# EasyEDA Pro project ChisFlash v1.1 雪拉比 时钟卡.epro

# Schematic ChisFlash-Celebi
Board Name: ChisFlash-Celebi; Create Date: 2024-10-07; Page Name: P1; Project Name: ChisFlash v1.1 雪拉比 Flash1M/RTC; Schematic Name: ChisFlash-Celebi; Update Date: 2024-10-07; Company: ChisBread/ChisFlash-Prometheus; Drawed: ChisBread; Page Size: A4; Reviewed: ChisBread; Version: 2
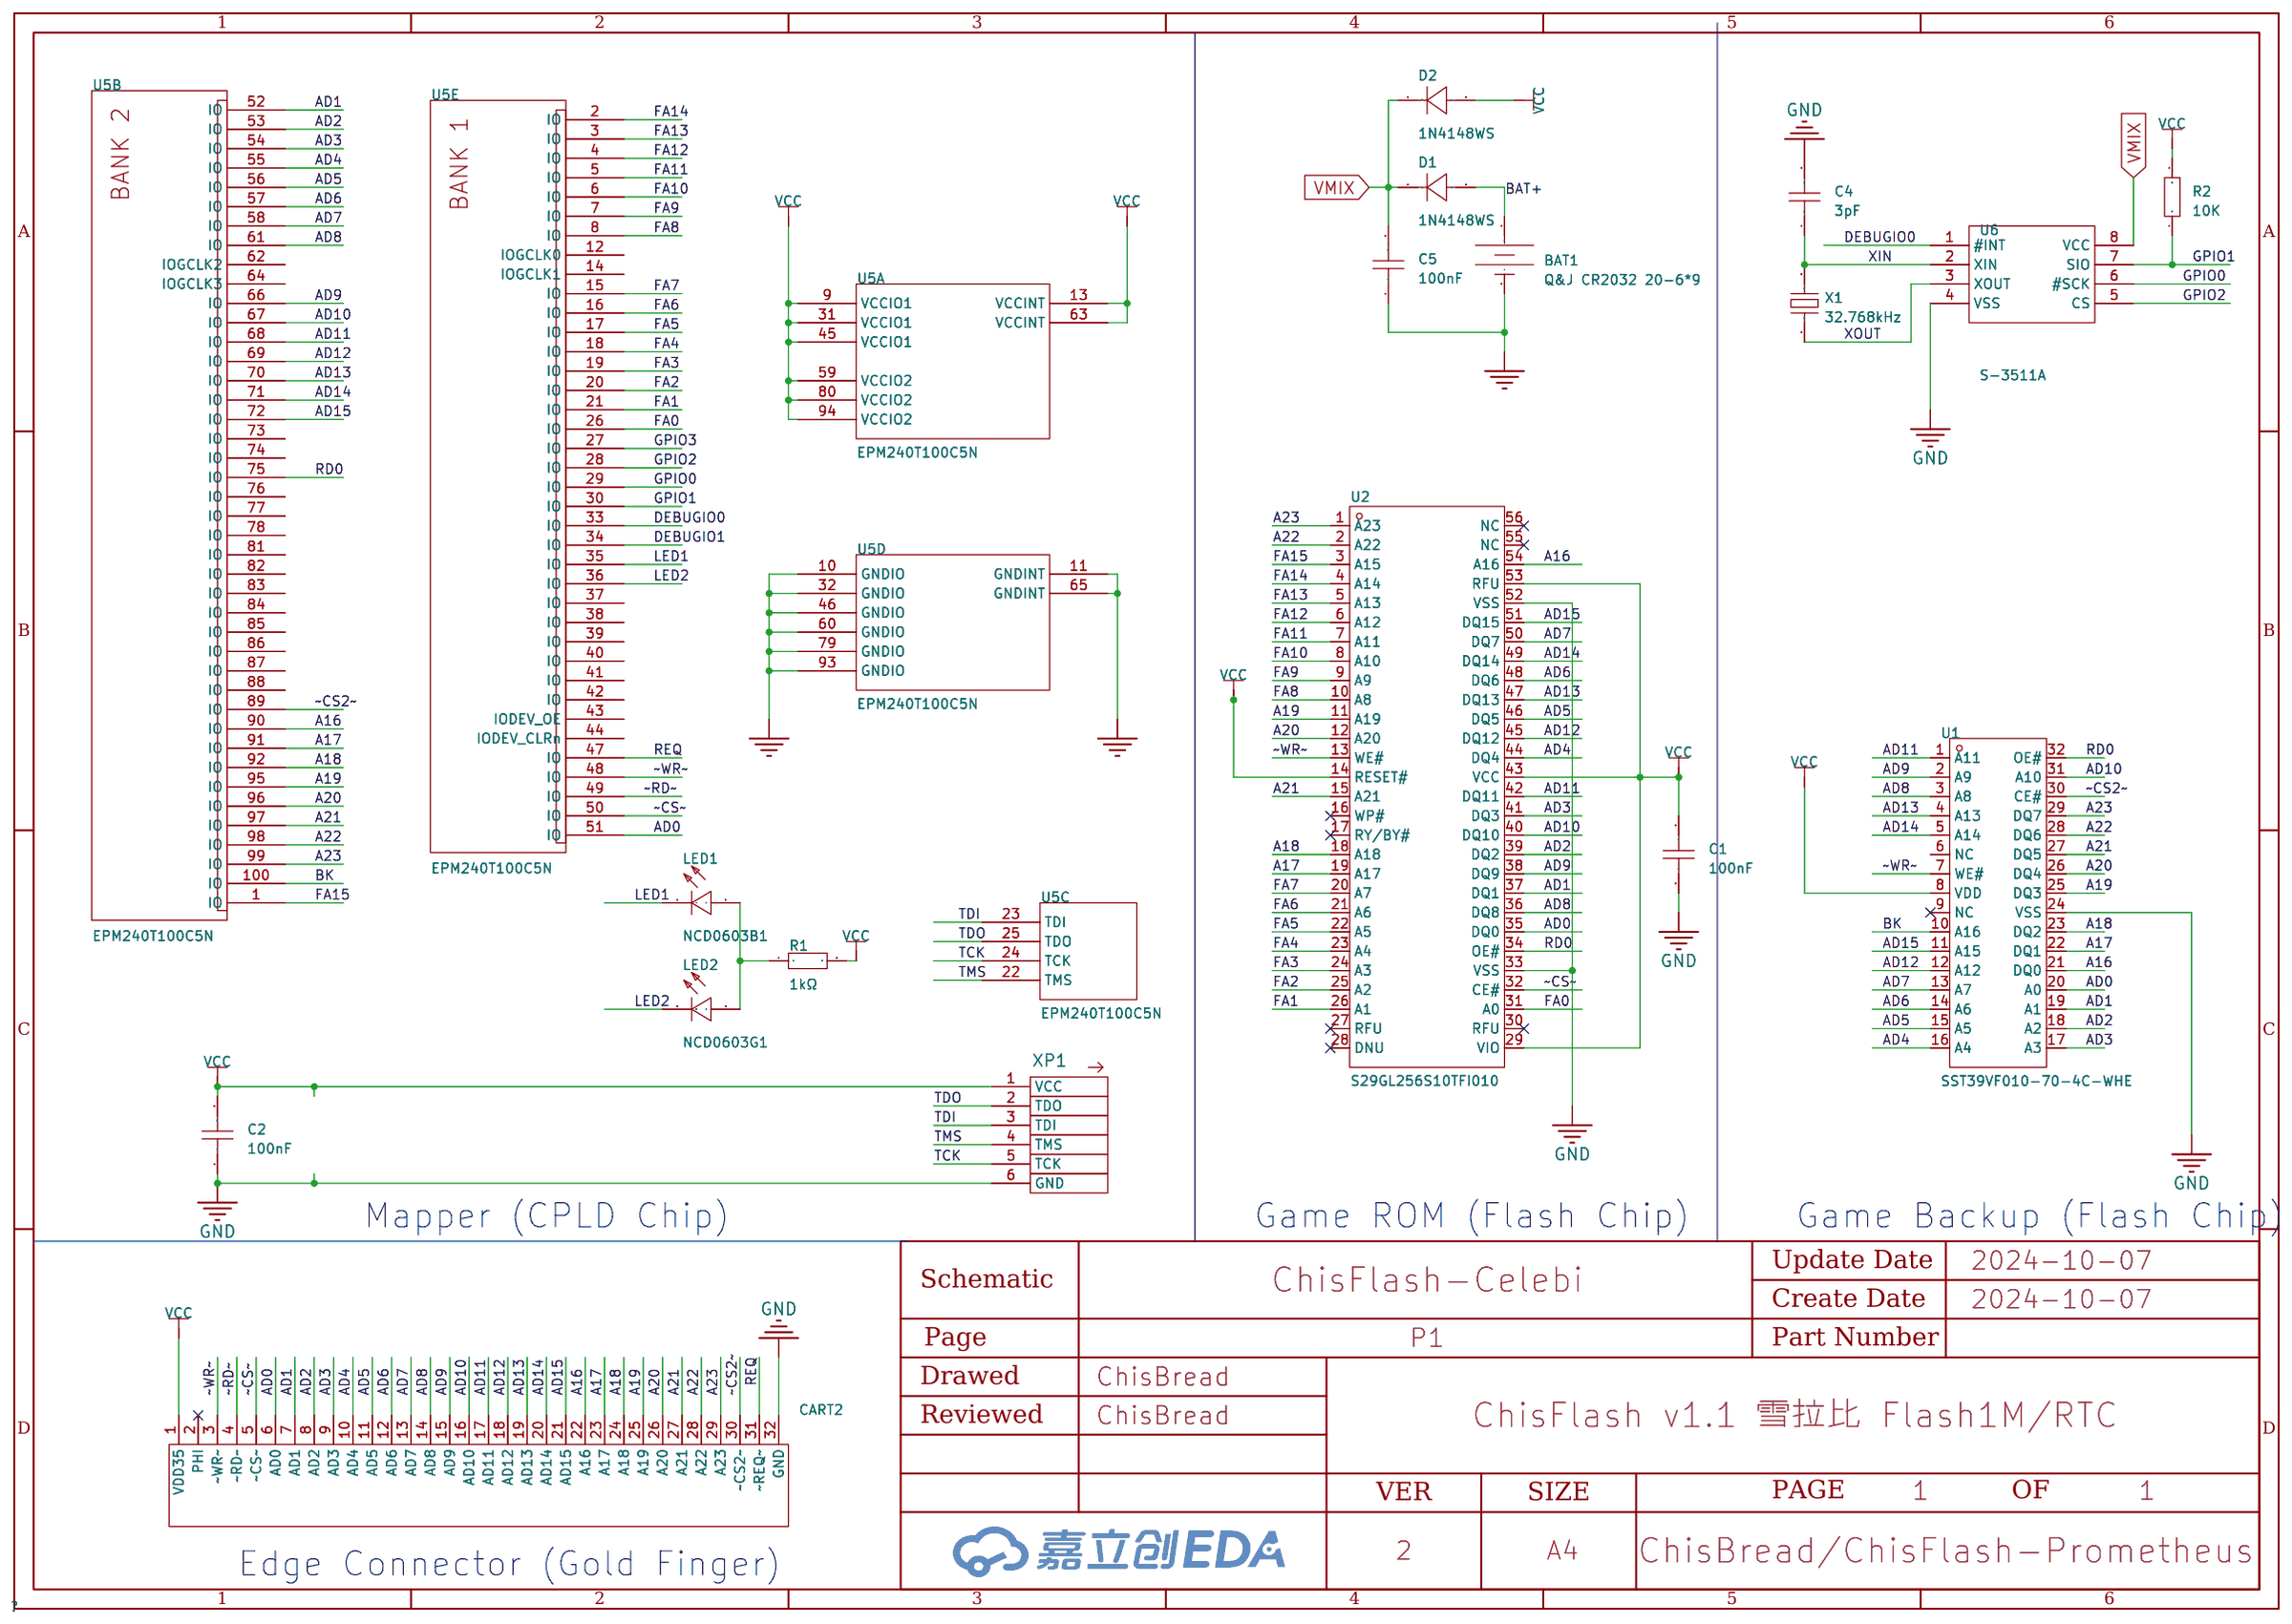
[diagram p0: schematic sheet]

## Parts
BAT1  Q&J CR2032 20-6*9  [BAT-TH_CR2032]
C1  100nF  [C0603]
C2  100nF  [C0603]
C4  3pF  [C0603]
C5  100nF  [C0603]
CART2  -  [GBA卡带金手指]  (no BOM)
D1  1N4148WS  [SOD-323_L1.8-W1.3-LS2.5-RD]
D2  1N4148WS  [SOD-323_L1.8-W1.3-LS2.5-RD]
LED1  NCD0603B1  [LED0603-RD]
LED2  NCD0603G1  [LED0603-RD]
R1  1kΩ  [R0603]
R2  10K  [R0603]
U1  SST39VF010-70-4C-WHE  [TSOP-32_L8.1-W12.5-P0.50-LS14.2-TL]
U2  S29GL256S10TFI010  [TSOP-56_L18.4-W14.0-P0.50-LS20.0-TL]
U5  EPM240T100C5N  [TQFP-100_L14.0-W14.0-P0.50-LS16.0-BL]  (sections 1,2,3,4,5)
U6  S-3511A  [3511-sop8]
X1  32.768kHz  [OSC-SMD_L3.2-W1.5]
XP1  JTAG  [HDR-TH_6P-P1.27-V-M-1]  (no BOM)

## Library data of the parts
BAT1 = Q&J CR2032 20-6*9: 直插; LCSC Part Name: Q&J， (卧式焊脚)纽扣电池，3V， CR2032 ,1只; Supplier Part: C70382; Manufacturer: Q&J; JLCPCB Part Class: Extended Part; Datasheet: https://atta.szlcsc.com/upload/public/pdf/source/20170428/1493376822625.pdf; Supplier: LCSC; brand: Q&J; voltage: 3v; capacity: 240mAh; chemical composition: 锂锰; temperature range: -20-60°C; size: 20*3.2mm; type: 纽扣; Packaging quantity: 1
C1 C2 C4 C5 = CAP_0603: Supplier Footprint: 0603
CART2 = GBA卡带金手指
D1 D2 = 1N4148WS_C917117: 二极管配置:独立式;正向压降(Vf):1.25V@150mA;直流反向耐压(Vr):100V;平均整流电流(Io):300mA;功率:400mW;反向恢复时间(trr):8ns;; LCSC Part Name: 电压:100V 电流:300mA; Supplier Part: C917117; Manufacturer: JSMSEMI(杰盛微); Supplier Footprint: SOD-323; JLCPCB Part Class: Extended Part; Datasheet: https://atta.szlcsc.com/upload/public/pdf/source/20230807/08D9F448A82EA88A23B325A669586A09.pdf; Supplier: LCSC; Diode Configuration: 独立式; Forward Voltage (Vf@If): 1.25V@150mA; Reverse Voltage (Vr): 100V; Average Rectified Current (Io): 300mA; Power Dissipation: 400mW; Reverse Leakage Current: 1uA@75V; Reverse Recovery Time (trr): 8ns; Operating Temperature: -55℃~+150℃@(Tj)
LED1 = NCD0603B1: 发光颜色:蓝色;正向电压(VF):2.6V~3.6V;功率:72mW;正向电流:10mA;主波长:463nm~475nm;透镜颜色:无色透明透镜;发光强度:80mcd~220mcd;发光角度:130°;工作温度:-30℃~+85℃;; Supplier Part: C84266; Manufacturer: 国星光电; Supplier Footprint: 0603; JLCPCB Part Class: 扩展库; Datasheet: https://atta.szlcsc.com/upload/public/pdf/source/20200820/C84266_6A3CDBEFA72C6CAD68EDA53474ADAE6C.pdf; Supplier: LCSC; Emitted Color: 蓝色; Forward Voltage (VF): 2.6V~3.6V; Power Dissipation: 72mW; Forward Current: 10mA; Dominant Wavelength: 463nm~475nm; Lens Color: 无色透明透镜; Luminous Intensity: 80mcd~220mcd; Viewing Angle: 130°; Operating Temperature: -30℃~+85℃
LED2 = NCD0603G1: 发光颜色:翠绿色;正向电压(VF):2.6V~3.6V;功率:72mW;正向电流:10mA;主波长:515nm~530nm;透镜颜色:无色透明透镜;发光强度:330mcd~900mcd;发光角度:130°;工作温度:-30℃~+85℃;; Supplier Part: C84267; Manufacturer: 国星光电; Supplier Footprint: 0603; JLCPCB Part Class: 扩展库; Datasheet: https://atta.szlcsc.com/upload/public/pdf/source/20200820/C84267_04BA7703640BAC111D09F5EFB971FBF3.pdf; Supplier: LCSC; Emitted Color: 翠绿色; Forward Voltage (VF): 2.6V~3.6V; Power Dissipation: 72mW; Forward Current: 10mA; Dominant Wavelength: 515nm~530nm; Lens Color: 无色透明透镜; Luminous Intensity: 330mcd~900mcd; Viewing Angle: 130°; Operating Temperature: -30℃~+85℃
R1 = 0603WAF1001T5E: 电阻类型:厚膜电阻;阻值:1kΩ;精度:±1%;功率:100mW;最大工作电压:75V;温度系数:±100ppm/℃;; LCSC Part Name: 1kΩ ±1% 100mW 厚膜电阻; Supplier Part: C21190; Manufacturer: UNI-ROYAL(厚声); Supplier Footprint: 0603; JLCPCB Part Class: 基础库; Datasheet: https://atta.szlcsc.com/upload/public/pdf/source/20200306/C422600_1E6D84923E4A46A82E41ADD87F860B5C.pdf; Supplier: LCSC; Type: 厚膜电阻; Tolerance: ±1%; Power(Watts): 100mW; Overload Voltage (Max): 75V; Temperature Coefficient: ±100ppm/℃; Operating Temperature Range: -55℃~+155℃
R2 = Res_0603: Supplier Footprint: 0603
U1 = SST39VF010-70-4C-WHE: Supplier Part: C633802; Manufacturer: MICROCHIP(美国微芯); Supplier Footprint: TSOP-32-12.5mm; JLCPCB Part Class: Extended Part; Datasheet: https://atta.szlcsc.com/upload/public/pdf/source/20140805/1457707202769.pdf; Supplier: LCSC
U2 = S29GL256S10TFI010: Supplier Part: C1350995; Manufacturer: SPANSION(飞索); Supplier Footprint: TSOP-56; JLCPCB Part Class: Extended Part; Datasheet: https://atta.szlcsc.com/upload/public/pdf/source/20201109/C914940_4A5E28132C9BE0EE19A790F58F84C86D.pdf; Supplier: LCSC
U5 = EPM240T100C5N: 类型:其它PLD;逻辑门数量:-;逻辑单元数:-;逻辑阵列块数:240;; Supplier Part: C10041; Manufacturer: Intel/Altera; Supplier Footprint: TQFP-100(14x14); JLCPCB Part Class: 扩展库; Datasheet: https://atta.szlcsc.com/upload/public/pdf/source/20121123/1457706563537.pdf; Supplier: LCSC; Type: 其它PLD; Supply Voltage Range - VCCIO: 3.3V；2.5V; Logic Array Blocks: 240; Maximum Delay Time Tpd: 4.7ns; Operating Temperature Range: 0℃~+85℃
U6 = 3511-SOP8: JLCPCB Part Class: 扩展库
X1 = X321532768KGD2SI: 晶振类型:贴片晶振;频率:32.768kHz;常温频差:±20ppm;外接负载电容:12.5pF;频率稳定度(全温):-;; LCSC Part Name: 32.768kHz ±20ppm 12.5pF; Supplier Part: C620155; Manufacturer: YXC(扬兴晶振); Supplier Footprint: SMD3215-2P; JLCPCB Part Class: Extended Part; Datasheet: https://atta.szlcsc.com/upload/public/pdf/source/20240329/3A7650FD985DD0DE85694D3785AB4916.pdf; Supplier: LCSC; Crystal Type: 贴片晶振; Normal temperature Frequency Tolerance: ±20ppm; External load capacitor: 12.5pF; Operating Temperature: -40℃~+85℃
XP1 = jtag

## Nets
GND: BAT1.2(-) C1.1 C2.1 C4.2 C5.1 CART2.32(GND) U1.24(VSS) U2.33(VSS) U2.52(VSS) U5.10(GNDIO) U5.11(GNDINT) U5.32(GNDIO) U5.46(GNDIO) U5.60(GNDIO) U5.65(GNDINT) U5.79(GNDIO) U5.93(GNDIO) U6.4(VSS) XP1.6(GND)
VCC: C1.2 C2.2 CART2.1(VDD35) D2.2(A) R1.2 R2.2 U1.8(VDD) U2.14(RESET#) U2.29(VIO) U2.43(VCC) U2.53(RFU) U5.9(VCCIO1) U5.13(VCCINT) U5.31(VCCIO1) U5.45(VCCIO1) U5.59(VCCIO2) U5.63(VCCINT) U5.80(VCCIO2) U5.94(VCCIO2) XP1.1(VCC)
A16: CART2.22(A16) U1.21(DQ0) U2.54(A16) U5.90(IO)
A17: CART2.23(A17) U1.22(DQ1) U2.19(A17) U5.91(IO)
A18: CART2.24(A18) U1.23(DQ2) U2.18(A18) U5.92(IO)
A19: CART2.25(A19) U1.25(DQ3) U2.11(A19) U5.95(IO)
A20: CART2.26(A20) U1.26(DQ4) U2.12(A20) U5.96(IO)
A21: CART2.27(A21) U1.27(DQ5) U2.15(A21) U5.97(IO)
A22: CART2.28(A22) U1.28(DQ6) U2.2(A22) U5.98(IO)
A23: CART2.29(A23) U1.29(DQ7) U2.1(A23) U5.99(IO)
AD0: CART2.6(AD0) U1.20(A0) U2.35(DQ0) U5.51(IO)
AD1: CART2.7(AD1) U1.19(A1) U2.37(DQ1) U5.52(IO)
AD2: CART2.8(AD2) U1.18(A2) U2.39(DQ2) U5.53(IO)
AD3: CART2.9(AD3) U1.17(A3) U2.41(DQ3) U5.54(IO)
AD4: CART2.10(AD4) U1.16(A4) U2.44(DQ4) U5.55(IO)
AD5: CART2.11(AD5) U1.15(A5) U2.46(DQ5) U5.56(IO)
AD6: CART2.12(AD6) U1.14(A6) U2.48(DQ6) U5.57(IO)
AD7: CART2.13(AD7) U1.13(A7) U2.50(DQ7) U5.58(IO)
AD8: CART2.14(AD8) U1.3(A8) U2.36(DQ8) U5.61(IO)
AD9: CART2.15(AD9) U1.2(A9) U2.38(DQ9) U5.66(IO)
AD10: CART2.16(AD10) U1.31(A10) U2.40(DQ10) U5.67(IO)
AD11: CART2.17(AD11) U1.1(A11) U2.42(DQ11) U5.68(IO)
AD12: CART2.18(AD12) U1.12(A12) U2.45(DQ12) U5.69(IO)
AD13: CART2.19(AD13) U1.4(A13) U2.47(DQ13) U5.70(IO)
AD14: CART2.20(AD14) U1.5(A14) U2.49(DQ14) U5.71(IO)
AD15: CART2.21(AD15) U1.11(A15) U2.51(DQ15) U5.72(IO)
BAT+: BAT1.1(+) D1.2(A)
BK: U1.10(A16) U5.100(IO)
DEBUGIO0: U5.33(IO) U6.1(#INT)
DEBUGIO1: U5.34(IO)
FA0: U2.31(A0) U5.26(IO)
FA1: U2.26(A1) U5.21(IO)
FA2: U2.25(A2) U5.20(IO)
FA3: U2.24(A3) U5.19(IO)
FA4: U2.23(A4) U5.18(IO)
FA5: U2.22(A5) U5.17(IO)
FA6: U2.21(A6) U5.16(IO)
FA7: U2.20(A7) U5.15(IO)
FA8: U2.10(A8) U5.8(IO)
FA9: U2.9(A9) U5.7(IO)
FA10: U2.8(A10) U5.6(IO)
FA11: U2.7(A11) U5.5(IO)
FA12: U2.6(A12) U5.4(IO)
FA13: U2.5(A13) U5.3(IO)
FA14: U2.4(A14) U5.2(IO)
FA15: U2.3(A15) U5.1(IO)
GPIO0: U5.29(IO) U6.6(#SCK)
GPIO1: R2.1 U5.30(IO) U6.7(SIO)
GPIO2: U5.28(IO) U6.5(CS)
GPIO3: U5.27(IO)
LED1: LED1.1(-) U5.35(IO)
LED2: LED2.1(K) U5.36(IO)
RD0: U1.32(OE#) U2.34(OE#) U5.75(IO)
REQ: CART2.31(~REQ~) U5.47(IO)
TCK: U5.24(TCK) XP1.5(TCK)
TDI: U5.23(TDI) XP1.3(TDI)
TDO: U5.25(TDO) XP1.2(TDO)
TMS: U5.22(TMS) XP1.4(TMS)
VMIX: C5.2 D1.1(C) D2.1(C) U6.8(VCC)
XIN: C4.1 U6.2(XIN) X1.2
XOUT: U6.3(XOUT) X1.1
~CS2~: CART2.30(~CS2~) U1.30(CE#) U5.89(IO)
~CS~: CART2.5(~CS~) U2.32(CE#) U5.50(IO)
~RD~: CART2.4(~RD~) U5.49(IO)
~WR~: CART2.3(~WR~) U1.7(WE#) U2.13(WE#) U5.48(IO)
$1N77583: LED1.2(+) LED2.2(A) R1.1

Not connected (* = marked no-connect by the designer): CART2 2(PHI)*; U1 6(NC) 9(NC)*; U2 16(WP#)* 17(RY/BY#)* 27(RFU)* 28(DNU)* 30(RFU)* 55(NC)* 56(NC)*; U5 12(IOGCLK0) 14(IOGCLK1) 37(IO) 38(IO) 39(IO) 40(IO) 41(IO) 42(IO) 43(IODEV_OE) 44(IODEV_CLRn) 62(IOGCLK2) 64(IOGCLK3) 73(IO) 74(IO) 76(IO) 77(IO) 78(IO) 81(IO) 82(IO) 83(IO) 84(IO) 85(IO) 86(IO) 87(IO) 88(IO)

## Notes on the sheet
- Mapper (CPLD Chip)
- Game ROM (Flash Chip)
- Game Backup (Flash Chip)
- Edge Connector (Gold Finger)

# Board ChisFlash-Celebi
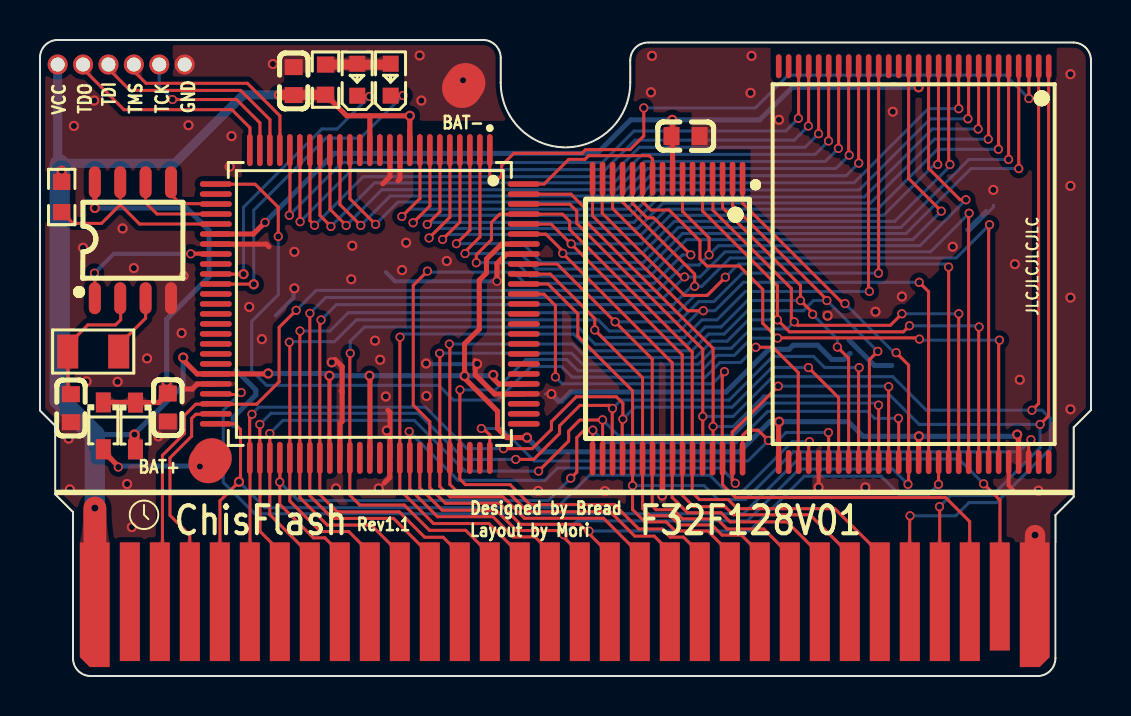
[diagram p1: board, top side]
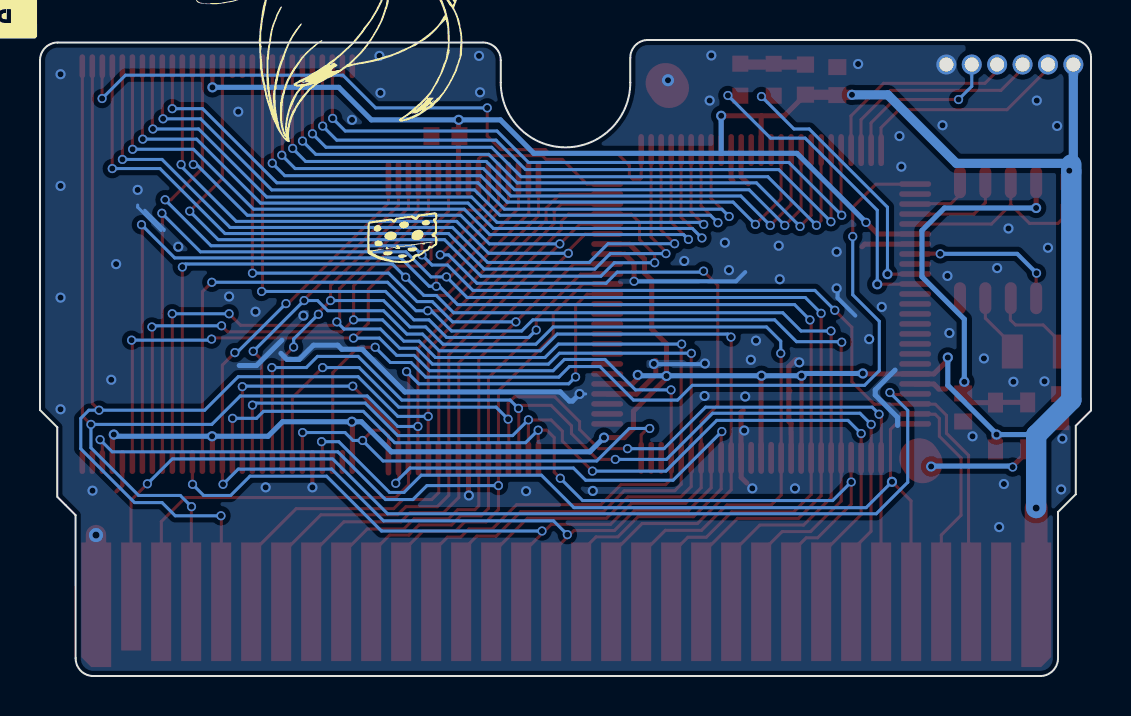
[diagram p2: board, bottom side, seen from below]

Outline 52.55 x 31.83 mm; copper layers: Top Layer, Bottom Layer. Coordinates in mm from the lower left corner of the outline.
Outline path: 0,30.94 0,13.28 0.76,12.52 0.76,9.09 1.65,8.2 1.65,0.89 arc(1.91,0.26) 2.54,0 49.88,0 arc(50.51,0.26) 50.77,0.89 50.77,8.05 51.28,8.56 51.69,8.97 51.69,12.45 52.55,13.31 52.55,30.81 arc(52.29,31.44) 51.66,31.7 30.4,31.7 arc(29.77,31.44) 29.51,30.81 29.52,29.69 arc(26.28,26.45) 23.04,29.69 23.04,30.94 arc(22.78,31.57) 22.15,31.83 0.89,31.83 arc(0.26,31.57) 0,30.94
Stack: Top Layer 0.035mm - / Dielectric1 1.51mm FR4 er 4.5 / Bottom Layer 0.035mm -

## Design rules (mm)
template: 自定义配置
spacing copperThickness1oz (default): track to track 0.152, other pairs 0.152 to 0.152
spacing copperThickness2oz: track to track 0.152, other pairs 0.152 to 0.152
track width copperThickness1oz (default): min 0.152, default 0.152, max 2.54
track width copperThickness2oz: min 0.152, default 0.254, max 2.54
differential pair differentialPair (default): width min 0.152, default 0.254, max 2.54; gap min 0.152, default 0.152
via viaSize (default): diameter min 0.406, default 0.457, max 10; hole min 0.305, default 0.305, max 6.299

## Placement (name value [footprint] x y rotation side)
BAT1  Q&J CR2032 20-6*9  [BAT-TH_CR2032]  14.83 20.14 236 top
C1  100nF  [C0603]  32.28 27.02 180 top
C2  100nF  [C0603]  12.68 29.77 270 top
C4  3pF  [C0603]  1.54 13.4 270 top
C5  100nF  [C0603]  6.39 13.44 90 top
CART2  -  [GBA卡带金手指]  26.22 3.04 0 top
D1  1N4148WS  [SOD-323_L1.8-W1.3-LS2.5-RD]  3.17 12.52 270 top
D2  1N4148WS  [SOD-323_L1.8-W1.3-LS2.5-RD]  4.77 12.51 270 top
LED1  NCD0603B1  [LED0603-RD]  15.86 29.84 90 top
LED2  NCD0603G1  [LED0603-RD]  17.54 29.84 90 top
R1  1kΩ  [R0603]  14.28 29.84 270 top
R2  10K  [R0603]  1.09 23.97 90 top
U1  SST39VF010-70-4C-WHE  [TSOP-32_L8.1-W12.5-P0.50-LS14.2-TL]  31.38 17.88 270 top
U2  S29GL256S10TFI010  [TSOP-56_L18.4-W14.0-P0.50-LS20.0-TL]  43.69 20.61 270 top
U5  EPM240T100C5N  [TQFP-100_L14.0-W14.0-P0.50-LS16.0-BL]  16.49 18.62 180 top
U6  S-3511A  [3511-sop8]  4.59 21.89 90 top
X1  32.768kHz  [OSC-SMD_L3.2-W1.5]  2.66 16.24 180 top
XP1  JTAG  [HDR-TH_6P-P1.27-V-M-1]  4.06 30.6 0 top

## Footprints (pads in the part's own frame, mm; a bottom-side part is the same pattern mirrored in y, then rotated)
3511-sop8
  oval 1.6x0.6 smd: 1(-2.981,1.85) 2(-2.981,0.58) 3(-2.981,-0.69) 4(-2.981,-1.96) 5(2.819,-1.96) 6(2.819,-0.69) 7(2.819,0.58) 8(2.819,1.85)
BAT-TH_CR2032
  oval 2.3x2 smd: 1(11.303,0) 2(-11.354,0)
C0603
  rect 0.8x0.9 smd: 1(-0.7,0) 2(0.7,0)
GBA卡带金手指
  custom 1.491x6.239 smd: 1(-23.48,0.522)
  custom 1.002x5.935 smd: 2(-21.724,0.673) 3(-20.224,0.673) 4(-18.724,0.673) 5(-17.224,0.673) 6(-15.725,0.673) 7(-14.225,0.673) 8(-12.724,0.673) 9(-11.224,0.673) 10(-9.724,0.673) 11(-8.224,0.673) 12(-6.724,0.673) 13(-5.224,0.673) 14(-3.724,0.673) 15(-2.224,0.673) 16(-0.724,0.673) 17(0.776,0.673) 18(2.276,0.673) 19(3.776,0.673) 20(5.276,0.673) 21(6.776,0.673) 22(8.276,0.673) 23(9.776,0.673) 24(11.276,0.673) 25(12.776,0.673) 26(14.276,0.673) 27(15.776,0.673) 28(17.276,0.673) 29(18.776,0.673) 30(20.276,0.673)
  rect 1.001x5.407 smd: 31(21.776,0.938)
  custom 1.492x6.239 smd: 32(23.522,0.522)
HDR-TH_6P-P1.27-V-M-1
  round 1 hole 0.7: 1(-3.175,0) 2(-1.905,0) 3(-0.635,0) 4(0.635,0) 5(1.905,0) 6(3.175,0)
LED0603-RD
  rect 0.8x0.8 smd: 1(-0.799,0) 2(0.799,0)
OSC-SMD_L3.2-W1.5
  rect 1.05x1.7 smd: 1(-1.275,0) 2(1.275,0)
R0603
  rect 0.806x0.864 smd: 1(-0.753,0) 2(0.753,0)
SOD-323_L1.8-W1.3-LS2.5-RD
  rect 1x0.75 smd: 1(-1.173,0) 2(1.173,0)
TQFP-100_L14.0-W14.0-P0.50-LS16.0-BL
  oval 0.28x1.6 smd: 1(-6,-7.7) 2(-5.5,-7.7) 3(-5,-7.7) 4(-4.5,-7.7) 5(-4,-7.7) 6(-3.5,-7.7) 7(-3,-7.7) 8(-2.5,-7.7) 9(-2,-7.7) 10(-1.5,-7.7) 11(-1,-7.7) 12(-0.5,-7.7) 13(0,-7.7) 14(0.5,-7.7) 15(1,-7.7) 16(1.5,-7.7) 17(2,-7.7) 18(2.5,-7.7) 19(3,-7.7) 20(3.5,-7.7) 21(4,-7.7) 22(4.5,-7.7) 23(5,-7.7) 24(5.5,-7.7) 25(6,-7.7) 51(6,7.7) 52(5.5,7.7) 53(5,7.7) 54(4.5,7.7) 55(4,7.7) 56(3.5,7.7) 57(3,7.7) 58(2.5,7.7) 59(2,7.7) 60(1.5,7.7) 61(1,7.7) 62(0.5,7.7) 63(0,7.7) 64(-0.5,7.7) 65(-1,7.7) 66(-1.5,7.7) 67(-2,7.7) 68(-2.5,7.7) 69(-3,7.7) 70(-3.5,7.7) 71(-4,7.7) 72(-4.5,7.7) 73(-5,7.7) 74(-5.5,7.7) 75(-6,7.7)
  oval 1.6x0.28 smd: 26(7.7,-6) 27(7.7,-5.5) 28(7.7,-5) 29(7.7,-4.5) 30(7.7,-4) 31(7.7,-3.5) 32(7.7,-3) 33(7.7,-2.5) 34(7.7,-2) 35(7.7,-1.5) 36(7.7,-1) 37(7.7,-0.5) 38(7.7,0) 39(7.7,0.5) 40(7.7,1) 41(7.7,1.5) 42(7.7,2) 43(7.7,2.5) 44(7.7,3) 45(7.7,3.5) 46(7.7,4) 47(7.7,4.5) 48(7.7,5) 49(7.7,5.5) 50(7.7,6) 76(-7.7,6) 77(-7.7,5.5) 78(-7.7,5) 79(-7.7,4.5) 80(-7.7,4) 81(-7.7,3.5) 82(-7.7,3) 83(-7.7,2.5) 84(-7.7,2) 85(-7.7,1.5) 86(-7.7,1) 87(-7.7,0.5) 88(-7.7,0) 89(-7.7,-0.5) 90(-7.7,-1) 91(-7.7,-1.5) 92(-7.7,-2) 93(-7.7,-2.5) 94(-7.7,-3) 95(-7.7,-3.5) 96(-7.7,-4) 97(-7.7,-4.5) 98(-7.7,-5) 99(-7.7,-5.5) 100(-7.7,-6)
TSOP-32_L8.1-W12.5-P0.50-LS14.2-TL
  oval 1.7x0.28 smd: 1(-7,3.75) 2(-7,3.25) 3(-7,2.75) 4(-7,2.25) 5(-7,1.75) 6(-7,1.25) 7(-7,0.75) 8(-7,0.25) 9(-7,-0.25) 10(-7,-0.75) 11(-7,-1.25) 12(-7,-1.75) 13(-7,-2.25) 14(-7,-2.75) 15(-7,-3.25) 16(-7,-3.75) 17(7,-3.75) 18(7,-3.25) 19(7,-2.75) 20(7,-2.25) 21(7,-1.75) 22(7,-1.25) 23(7,-0.75) 24(7,-0.25) 25(7,0.25) 26(7,0.75) 27(7,1.25) 28(7,1.75) 29(7,2.25) 30(7,2.75) 31(7,3.25) 32(7,3.75)
TSOP-56_L18.4-W14.0-P0.50-LS20.0-TL
  oval 1.199x0.28 smd: 1(-9.901,6.752) 2(-9.901,6.251) 3(-9.901,5.75) 4(-9.901,5.25) 5(-9.901,4.75) 6(-9.901,4.25) 7(-9.901,3.749) 8(-9.901,3.251) 9(-9.901,2.751) 10(-9.901,2.251) 11(-9.901,1.75) 12(-9.901,1.25) 13(-9.901,0.75) 14(-9.901,0.249) 15(-9.901,-0.249) 16(-9.901,-0.75) 17(-9.901,-1.25) 18(-9.901,-1.75) 19(-9.901,-2.251) 20(-9.901,-2.751) 21(-9.901,-3.248) 22(-9.901,-3.749) 23(-9.901,-4.25) 24(-9.901,-4.75) 25(-9.901,-5.25) 26(-9.901,-5.75) 27(-9.901,-6.251) 28(-9.901,-6.749) 29(9.901,-6.749) 30(9.901,-6.251) 31(9.901,-5.75) 32(9.901,-5.25) 33(9.901,-4.75) 34(9.901,-4.25) 35(9.901,-3.749) 36(9.901,-3.248) 37(9.901,-2.751) 38(9.901,-2.251) 39(9.901,-1.75) 40(9.901,-1.25) 41(9.901,-0.75) 42(9.901,-0.249) 43(9.901,0.249) 44(9.901,0.75) 45(9.901,1.25) 46(9.901,1.75) 47(9.901,2.251) 48(9.901,2.751) 49(9.901,3.251) 50(9.901,3.749) 51(9.901,4.25) 52(9.901,4.75) 53(9.901,5.25) 54(9.901,5.75) 55(9.901,6.251) 56(9.901,6.752)

## Nets
As in the schematic.

Pads without a net: CART2 2; U1 6 9; U2 16 17 27 28 30 55 56; U5 12 14 37 38 39 40 41 42 43 44 62 64 73 74 76 77 78 81 82 83 84 85 86 87 88

## Via types
v1: diameter 0.457, hole 0.305, Top Layer to Bottom Layer, 129 vias
v2: diameter 0.508, hole 0.305, Top Layer to Bottom Layer, 85 vias
v3: diameter 0.711, hole 0.355, Top Layer to Bottom Layer, 2 vias
v4: diameter 0.61, hole 0.305, Top Layer to Bottom Layer, 1 via

## Routing (per net, layer and track width the routed paths; a pad name or vN(x,y) marks a point on that pad's centre or on a via; arc(x,y) is an arc through that point)
GND: length 68
  Top Layer w0.203: U2.52 48.44,9.54 48.74,9.24 ; U2.33 38.94,9.44 v2(38.93,9.44)
  Top Layer w0.254: 8.8,21.61 11.32,21.61 11.45,21.48 ; U1.24 31.13,9.05 v2(31.11,9.03) ; U5.60 15,12.63 15.11,12.74 15.11,14.22 ; 17.39,13.3 17.5,13.2 17.5,10.91 ; 8.8,14.61 7.86,14.61 7.61,14.36 7.25,14.36 ; 14.75,15.84 15.11,15.49 15.11,14.22 ; 21.76,15.79 21.76,15.08 22.73,14.11 24.2,14.11 ; 17.14,24.63 17.5,24.99 17.5,26.31 ; 15.11,14.22 15.06,14.27 ; 24.2,21.11 23.32,21.11 22.85,20.64 v1(22.85,19.75) ; 17.21,9.66 17.49,9.94 17.49,10.73 ; 17.9,24.78 18,24.88 18,26.31
  Top Layer w1.016: 49.75,2.94 v3(49.75,7.05)
  Bottom Layer w0.152: v2(25.57,14.11) 25.27,14.11 ; 47.31,23.31 46.35,22.34 46.35,22.29 ; 46.5,22.29 47.67,23.46 47.67,23.56
  Bottom Layer w0.203: v1(22.85,19.75) 17.75,19.75 17.29,20.21 ; 19.32,15.56 19.37,15.61 21.9,15.61 ; 12.67,19.48 12.67,18.92 11.79,18.03
  Bottom Layer w0.254: 40.51,16.15 40.2,15.84 39.59,15.84 38.88,16.55 37.66,16.55 37.46,16.35 36.44,16.35 34.31,14.22 26.54,14.22 26.08,13.76 25.93,13.76 v2(25.57,14.11) ; 42.59,15.54 41.73,15.54 40.46,16.81 ; 9.67,12.54 9.67,12.95 10.79,14.06 10.79,14.32 9.8,15.31
  vias: v2(1.43,11.88) v2(1.49,9.34) v2(1.7,27.52) v2(2.15,21.43) v2(2.33,14.74) v2(2.71,28.8) v2(3.88,14.72) v2(4.13,22.39) v2(4.36,9.61) v2(4.59,7.45) v2(4.69,20.41) v2(5.35,15.89) v2(5.92,11.99) v2(7.18,20.02) v2(7.08,17.16) v2(7.42,27.56) v2(9.58,27.02) v2(9.48,25.49) v2(10.46,18.47) v2(11.09,16.86) v2(11.65,30.62) v2(12.72,21.23) v2(12.72,19.4) v2(14.59,15.69) v2(14.8,9.39) v2(15.56,19.85) v2(15.62,21.53) v2(16.75,16.78) v2(16.94,9.39) v2(17.01,15.82) v2(17.29,13.99) v2(17.34,12.28) v2(18.1,20.31) v2(18.31,21.68) v2(18.99,31.05) v2(19.07,28.8) v2(19.31,15.64) v2(19.32,14.01) v2(20.34,20.77) v2(21.86,15.62) v2(24.91,9.26) v2(28.25,9.25) v2(30.55,29.21) v2(30.6,31.03) v2(35.53,29.18) v2(35.58,31.03) v2(36.95,27.83) v2(39.38,18.03) v2(41.27,9.44) v2(41.78,18.23) v2(42.64,28.24) v2(43.1,18.99) v2(45.64,21.48) v2(47.67,24.32) v2(48.75,20.61) v2(48.99,14.83) v2(49.93,9.28) v2(51.53,30.11) v2(51.53,24.52) v2(51.53,18.94) v2(51.53,13.35) v4(21.15,29.81)
VCC: length 172.9
  Top Layer w0.203: v2(14.48,15.03) 14.48,10.93 14.5,10.91 ; v2(43.93,29.46) 43.93,30.51
  Top Layer w0.254: U5.9 v2(18.49,28.03) 16.48,28.03 ; v2(36.96,12.72) 36.93,12.7 36.93,10.33 ; v1(11.25,22.7) 10.67,22.12 U5.31 ; 16.48,28.03 16.49,28.02 U5.13 ; 16.48,28.03 15.33,28.03 R1.2 ; v2(11.41,15.14) 11.39,15.12 U5.45 7.86,15.12 7.16,15.81 v2(7.16,15.94) ; 16.5,10.91 16.5,15.01 v2(16.48,15.03) ; 24.2,21.61 23.07,21.61 22.33,20.86 22.33,20.16 21.97,19.8 21.97,17.36 21.23,16.62 v2(21.23,15.01) 21.23,14.9 22.88,13.25 22.88,12.39 23.34,11.93 v2(24.35,11.93) ; 31.63,24.93 31.63,27.82 v2(31.62,27.83) ; v2(22.66,15.07) 22.66,14.89 22.94,14.61 24.2,14.61 ; 48.93,10.54 48.93,12.01 v2(48.86,12.08) ; 43.93,10.54 43.93,11.98 v2(43.95,12)
  Top Layer w0.508: v2(11.95,29.08) 14.27,29.08 R1.2 ; v1(1.09,25.29) R2.2 ; v2(4.72,12.08) 4.72,11.34
  Top Layer w1.143: 2.74,4.63 v3(2.74,8.41)
  Bottom Layer w0.254: v2(18.49,28.03) 18.49,26.17 18.48,26.15 ; 2.71,12.08 v2(4.72,12.08) 4.72,12.11 7.16,14.55 v2(7.16,15.94) ; v2(11.41,15.14) 14.36,15.14 v2(14.48,15.03) v2(16.48,15.03) 22.62,15.03 v2(22.66,15.07) ; v2(24.35,11.93) 25.06,11.22 34.98,11.22 36.48,12.72 v2(36.96,12.72) 40.42,12.72 41.15,12 v2(43.95,12) 48.78,12 v2(48.86,12.08) ; 18.48,26.15 27.86,26.15 29.53,27.83 v2(31.62,27.83) 35.99,27.83 37.61,29.46 v2(43.93,29.46) ; 18.48,26.15 14.71,26.15 v1(11.25,22.7)
  Bottom Layer w0.457: v2(11.95,29.08) 10.16,29.08 6.73,25.65 1.04,25.65 0.98,25.59 ; XP1.1 0.88,25.34 0.98,25.24
  Bottom Layer w1.016: 0.98,25.59 0.98,13.81 2.71,12.08 2.74,12.05 v3(2.74,8.41)
A16: length 45.1
  Top Layer w0.152: 34.49,3.67 34.49,6.16 33.4,7.26 31.77,7.26 31.31,7.71 30.25,7.71 29.63,8.33 v1(29.63,9.53) U1.21 29.63,14.27 26.89,17.01 26.89,18.13 25.4,19.62 U5.90 ; v1(49.55,11.83) 49.44,11.71 49.44,10.71
  Bottom Layer w0.152: v1(49.55,11.83) 48.94,11.22 37.66,11.22 35.27,8.83 33.9,8.83 33.21,9.53 v1(29.63,9.53)
A17: length 50.2
  Top Layer w0.152: 35.99,3.67 35.99,6.13 35.07,7.05 34.11,7.05 33.6,7.56 31.97,7.56 31.52,8.02 30.5,8.02 30.13,8.39 30.13,14.92 v1(27.74,17.31) 27.74,17.89 25.52,20.11 24.2,20.11 ; 41.37,30.4 41.43,30.34 41.43,19.29 v1(41.47,19.24)
  Bottom Layer w0.152: v1(41.47,19.24) 35.27,19.24 33.85,17.82 33.1,17.82 32.22,16.94 28.11,16.94 v1(27.74,17.31)
A18: length 50.4
  Top Layer w0.152: 24.2,20.61 24.21,20.62 25.86,20.62 v1(28.76,17.72) 30.61,15.87 30.61,8.51 30.8,8.32 31.67,8.32 32.13,7.87 33.85,7.87 34.36,7.36 36.19,7.36 37.49,6.06 37.49,3.67 ; v1(41.93,20.16) 41.93,20.16 41.93,30.34
  Bottom Layer w0.152: v1(41.93,20.16) 35.12,20.16 33.7,18.74 32.94,18.74 31.92,17.72 v1(28.76,17.72)
A19: length 54.1
  Top Layer w0.152: 24.2,22.11 25.3,22.11 26.14,21.27 v1(26.14,21.15) 31.61,15.67 31.61,8.94 32.38,8.17 34.06,8.17 34.51,7.71 37.36,7.71 38.99,6.08 38.99,3.67 ; v1(45.5,25.59) 45.44,25.66 U2.11
  Bottom Layer w0.152: v1(26.14,21.15) 30.12,21.15 31.72,22.75 42.74,22.75 45.5,25.51 v1(45.5,25.59)
A20: length 54.1
  Top Layer w0.152: v1(44.89,25.59) 44.93,25.63 44.93,30.03 ; 24.2,22.61 25.56,22.61 26.55,21.62 v1(26.56,21.62) 32.11,16.07 32.11,9.05 32.68,8.47 34.26,8.47 34.67,8.07 38.5,8.07 40.49,6.08 40.49,3.67
  Bottom Layer w0.152: v1(26.56,21.62) 30.08,21.62 31.52,23.05 42.18,23.05 44.72,25.59 v1(44.89,25.59)
A21: length 68.4
  Top Layer w0.152: 41.99,3.67 41.99,6.13 39.75,8.37 34.87,8.37 34.41,8.83 32.97,8.83 32.61,9.19 32.61,16.22 26.49,22.34 26.49,22.75 26.13,23.11 22.99,23.11 22.58,22.7 22.58,21.84 21.82,21.08 v1(21.82,20.68) ; 43.43,30.34 43.43,24.9 v1(45.07,23.26)
  Bottom Layer w0.152: v1(45.07,23.26) 43.64,21.84 32.33,21.84 30.5,20.01 24.51,20.01 23.83,20.68 v1(21.82,20.68)
A22: length 68
  Top Layer w0.152: 43.49,3.67 43.49,8 v1(43.5,8.02) ; 33.09,11.2 33.14,11.25 33.14,16.35 26.84,22.65 26.84,23.26 26.49,23.61 24.2,23.61 ; v1(49.6,13.3) 49.93,13.63 49.93,30.34
  Bottom Layer w0.152: v1(43.5,8.02) 45.79,8.02 46.45,8.68 47.82,8.68 50.52,11.37 50.52,12.89 50.11,13.3 v1(49.6,13.3) 44.32,13.3 42.64,14.98 36.65,14.98 34.66,12.99 v1(33.14,12.99)
A23: length 65.6
  Top Layer w0.152: 24.2,24.11 26.55,24.11 27.25,23.41 27.25,22.8 33.66,16.39 v1(33.66,12.49) 33.66,11.57 33.61,11.51 ; v1(44.98,8.47) 44.99,8.47 44.99,3.67 ; v1(50.01,12.59) 50.43,13.02 50.43,30.34
  Bottom Layer w0.152: v1(33.66,12.49) 34.67,12.49 36.19,14.01 42.54,14.01 43.96,12.59 v1(50.01,12.59) 50.01,11.42 47.62,9.03 45.54,9.03 v1(44.98,8.47)
AD0: length 49
  Top Layer w0.152: 39.93,10.54 39.93,13.92 v1(38.42,15.43) ; 10.5,10.71 10.5,3.1 ; v1(23.18,11.38) 24.61,11.38 25.57,12.34 25.57,12.73 26.82,13.97 28.82,13.97 29.15,13.65 v1(29.15,12.85) 29.11,12.82 29.11,11.22 ; 10.52,11.12 10.48,11.16 10.48,12.98 v1(10.6,13.1)
  Bottom Layer w0.152: v1(29.15,12.85) 29.75,13.45 34.61,13.45 36.6,15.43 v1(38.42,15.43) ; v1(10.6,13.1) 10.6,13.11 10.94,13.45 19.27,13.45 21.35,11.38 v1(23.18,11.38)
AD1: length 50
  Top Layer w0.152: 40.93,10.54 40.93,15.41 v1(40.96,15.43) ; v1(23.79,10.84) 24.68,10.84 25.98,12.13 25.98,12.52 27,13.54 28.48,13.54 v1(28.63,13.39) 28.61,13.38 28.61,11.22 ; 11.01,10.6 11,10.59 11,7.24 12,6.24 12,3.67 ; U5.52 v1(10.99,12.59)
  Bottom Layer w0.152: v1(40.96,15.43) 39.24,15.43 38.68,15.99 36.65,15.99 34.46,13.81 29.05,13.81 v1(28.63,13.39) ; v1(23.79,10.84) 21.23,10.84 18.92,13.15 11.55,13.15 v1(10.99,12.59)
AD2: length 47.9
  Top Layer w0.152: 13.5,3.67 13.5,6.07 11.49,8.08 11.49,10.9 11.5,10.91 ; U2.39 41.94,13.55 v1(41.93,13.55) ; v1(24.93,10.25) 26.43,11.76 26.43,12.25 26.99,12.81 28.12,12.81 v1(28.13,12.82) 28.13,11.24 28.11,11.22 ; v1(11.49,12.13) U5.53
  Bottom Layer w0.152: v1(11.49,12.13) 12.15,12.79 18.71,12.79 21.25,10.25 v1(24.93,10.25) ; v1(41.93,13.55) 41.83,13.66 36.29,13.66 34.67,12.03 28.92,12.03 v1(28.13,12.82)
AD3: length 47
  Top Layer w0.152: 12,10.91 12,9.72 v1(11.99,9.71) 11.99,8.6 13.67,6.91 14.24,6.91 15,6.16 15,3.67 ; 42.94,10.71 42.94,12.88 v1(42.93,12.89) ; 27.6,11.17 27.64,11.21 v1(27.64,12.3) 27.21,12.3 26.84,11.93 26.84,10.2 v1(26.54,9.9)
  Bottom Layer w0.152: v1(27.64,12.3) 28.27,11.68 34.82,11.68 36.39,13.24 41.38,13.24 41.73,12.89 v1(42.93,12.89) ; v1(26.54,9.9) 25.42,8.78 12.92,8.78 v1(11.99,9.71)
AD4: length 64.8
  Top Layer w0.152: v1(33.17,18.28) 32.38,18.28 27.63,23.03 27.63,24.93 ; v1(12.47,16.7) 12.49,16.68 U5.55 12.49,8.76 14.02,7.23 15.44,7.23 16.32,6.34 ; v1(43.96,19.7) 44.43,19.23 44.43,10.54
  Bottom Layer w0.152: v1(12.47,16.7) 12.49,16.73 14.73,16.73 15.82,17.82 27.91,17.82 28.47,17.26 31.97,17.26 32.99,18.28 v1(33.17,18.28) 33.75,18.28 35.17,19.7 v1(43.96,19.7)
AD5: length 68
  Top Layer w0.152: v1(34.27,19.96) 33.36,19.04 32.22,19.04 28.11,23.16 28.11,24.92 28.13,24.93 ; 17.79,6.32 16.56,7.55 14.37,7.55 12.99,8.93 U5.56 12.99,17.26 ; v1(45.43,20.46) 45.43,10.54 45.43,10.54
  Bottom Layer w0.152: v1(45.43,20.46) 45.28,20.62 34.93,20.62 v1(34.27,19.96) 33.36,19.04 32.73,19.04 31.87,18.18 15.41,18.18 14.5,17.26 v1(13,17.26)
AD6: length 70.3
  Top Layer w0.152: v1(32.23,19.97) 32.05,19.97 28.63,23.4 28.63,24.93 ; 46.43,10.54 46.43,23.13 v1(46.46,23.16) ; 19.3,6.3 19.26,6.3 17.68,7.89 14.63,7.89 13.49,9.02 U5.57 13.49,18.14 v1(13.49,18.15)
  Bottom Layer w0.152: v1(46.46,23.16) 44.53,21.23 34.26,21.23 33,19.97 v1(32.23,19.97) 31.2,18.94 14.29,18.94 v1(13.49,18.15)
AD7: length 71.6
  Top Layer w0.152: v1(32.73,19.5) 32.73,20.11 29.13,23.72 29.13,24.93 ; v1(14.05,17.82) 13.99,17.76 U5.58 13.99,9.08 14.86,8.21 17.97,8.21 19.24,6.94 20.16,6.94 21.26,5.84 21.26,5.78 ; v1(47.48,22.58) 47.43,22.54 U2.50
  Bottom Layer w0.152: v1(47.48,22.58) 45.82,20.92 34.51,20.92 33.09,19.5 v1(32.73,19.5) 32.59,19.5 31.67,18.58 14.82,18.58 v1(14.05,17.82)
AD8: length 59.4
  Top Layer w0.152: 34.13,24.93 34.13,23.44 38.03,19.54 v1(38.03,18.79) 38.63,18.18 v1(38.63,18.1) ; 22.49,3.67 22.49,6.08 21.29,7.29 19.48,7.29 18.21,8.56 15.99,8.56 15.49,9.05 U5.61 15.49,16.12 v1(15.51,16.15) ; v1(39.87,16.46) 40.43,15.9 40.43,10.54
  Bottom Layer w0.152: v1(38.63,18.1) 39.87,16.86 v1(39.87,16.46) ; v1(15.51,16.15) 15.51,16.76 16.23,17.47 26.89,17.47 27.76,16.6 32.4,16.6 33.27,17.47 34.06,17.47 35.38,18.79 v1(38.03,18.79)
AD9: length 57.6
  Top Layer w0.152: U2.38 41.47,10.75 41.47,15.83 v1(41.89,16.25) ; 23.99,3.67 23.99,6.08 22.45,7.63 19.68,7.63 17.99,9.32 U5.66 17.99,16.95 v1(18,16.96) ; v1(39.35,18.79) 39.35,18.83 34.63,23.55 34.63,24.93
  Bottom Layer w0.152: v1(41.89,16.25) 41.89,16.25 v1(39.35,18.79) 38.67,18.79 38.17,18.28 35.38,18.28 34.21,17.11 33.43,17.11 32.59,16.27 27.53,16.27 26.69,17.11 18.16,17.11 v1(18,16.96)
AD10: length 47
  Top Layer w0.152: 42.43,10.54 42.43,14.47 v1(42.44,14.48) ; v1(36.91,14.5) 34.61,12.2 34.61,11.23 ; v1(34.77,9.64) 34.61,9.8 34.61,11.17 ; v1(18.46,12.23) 18.49,12.2 U5.67 18.49,9.36 19.88,7.97 22.65,7.97 23.66,6.96 24.75,6.96 25.49,6.22 25.49,3.67
  Bottom Layer w0.152: v1(34.77,9.64) 34.77,9.7 34.06,10.41 25.88,10.41 25.27,9.8 20.9,9.8 v1(18.46,12.23) ; v1(42.44,14.48) 42.41,14.5 v1(36.91,14.5)
AD11: length 51.2
  Top Layer w0.152: 26.99,3.67 26.99,3.67 26.99,6.24 26.89,6.24 25.85,7.28 23.83,7.28 22.81,8.3 20.11,8.3 18.99,9.42 U5.68 ; v1(42.81,16.18) 43.43,15.56 43.43,9.62 v1(43.4,9.59) ; v1(40.25,18.63) 40.15,18.63 35.13,23.66 35.13,24.93
  Bottom Layer w0.152: v1(40.25,18.63) 42.71,16.18 v1(42.81,16.18) ; v1(43.4,9.59) 42.64,10.35 37.97,10.35 35.38,7.76 26.87,7.76 v1(26.19,7.08)
AD12: length 63.8
  Top Layer w0.152: v1(19.37,20.26) 18.66,19.55 18.66,13.55 19.49,12.73 U5.69 19.49,9.42 20.27,8.64 22.97,8.64 24.02,7.59 26.99,7.59 28.34,6.24 28.47,6.24 28.47,3.69 28.49,3.67 ; 44.93,10.54 44.93,9.6 v1(44.93,9.59) ; 29.63,24.93 29.63,23.65 30.35,22.93 30.69,22.93 v1(32.54,21.07)
  Bottom Layer w0.152: v1(32.54,21.07) 32.13,21.07 30.7,19.65 24.25,19.65 23.69,20.21 19.43,20.21 v1(19.37,20.26) ; v1(44.93,9.59) 44.37,9.03 43.02,9.03 42.05,10 38.22,10 35.48,7.26 v1(27.45,7.26)
AD13: length 64.3
  Top Layer w0.152: 45.94,10.71 45.94,18.12 v1(45.94,18.13) ; v1(19.98,16.15) 19.99,16.14 U5.70 19.99,9.48 20.51,8.97 23.15,8.97 24.22,7.89 28.18,7.89 29.84,6.24 29.99,6.24 29.99,3.67 ; 33.63,24.93 33.65,24.91 33.65,23.31 37.57,19.39 37.57,17.86 v1(37.71,17.72) 37.88,17.55 42.52,17.55 v1(43.1,18.13)
  Bottom Layer w0.152: v1(37.71,17.72) 37.36,17.36 35.53,17.36 34.56,16.4 33.72,16.4 32.93,15.61 27.13,15.61 26.58,16.15 19.99,16.15 v1(19.98,16.15) ; v1(43.1,18.13) v1(45.94,18.13)
AD14: length 62.8
  Top Layer w0.152: v1(43.48,17.53) 43.17,17.22 37.47,17.22 v1(36.87,17.82) 36.87,19.53 33.13,23.27 33.13,24.93 ; 20.49,16.58 U5.71 20.49,9.59 20.81,9.27 23.33,9.27 24.39,8.22 28.52,8.22 29.74,7 30.71,7 31.45,6.26 31.5,6.26 ; v1(20.47,16.61) 20.5,16.58 ; U2.49 46.94,17.44 v1(46.96,17.47)
  Bottom Layer w0.152: v1(20.47,16.61) 26.63,16.61 27.3,15.94 32.78,15.94 33.6,16.76 34.36,16.76 35.43,17.82 v1(36.87,17.82) ; v1(46.96,17.47) 46.9,17.53 v1(43.48,17.53)
AD15: length 67.5
  Top Layer w0.152: U2.51 47.94,16.77 v1(47.98,16.81) ; 30.13,24.93 30.13,23.74 30.55,23.32 31.46,23.32 33,21.77 33,20.87 33.35,20.51 34.97,20.51 36.14,19.35 36.14,17.65 v1(36.88,16.91) 36.89,16.92 43.91,16.92 v1(43.97,16.86) ; 32.99,3.67 32.99,6.14 32.18,6.95 31.52,6.95 31.11,7.36 29.94,7.36 28.72,8.58 24.51,8.58 23.51,9.58 21.27,9.58 20.99,9.85 U5.72 20.99,14.31 v1(21,14.32)
  Bottom Layer w0.152: v1(43.97,16.86) 44.03,16.81 v1(47.98,16.81) ; v1(36.88,16.91) 35.58,16.91 34.72,16.04 33.85,16.04 33.08,15.28 26.9,15.28 26.33,15.84 24.3,15.84 22.78,14.32 v1(21,14.32)
BAT+: length 5.6
  Top Layer w0.254: v1(3.92,10.46) 3.92,10.5 3.07,11.35 ; v2(8,10.48) 7.98,10.47 7.86,10.47 7.94,10.56
  Bottom Layer w0.254: v2(8,10.48) 7.97,10.51 3.97,10.51 v1(3.92,10.46)
BK: length 8
  Top Layer w0.152: 30.63,24.93 30.63,25.87 30.46,26.04 27.44,26.04 27.25,25.85 26.44,25.85 25.2,24.62 U5.100
DEBUGIO0: length 7.8
  Top Layer w0.152: v1(2.72,20.16) 2.74,20.14 U6.1
  Top Layer w0.203: 8.86,21.13 7.55,21.13 v1(7.54,21.12)
  Bottom Layer w0.203: v1(7.54,21.12) 3.69,21.12 v1(2.72,20.16)
FA0: length 47
  Top Layer w0.152: v1(35.79,16.45) 36.65,16.45 37.92,15.18 37.92,10.53 37.92,10.53 ; v1(11.91,21.99) 11.91,23.45 10.76,24.61 8.8,24.61
  Bottom Layer w0.152: v1(11.91,21.99) 11.91,19.08 10.59,17.75 10.59,15.28 11.32,14.54 19.94,14.54 20.67,13.81 22.88,13.81 24.56,15.49 26.08,15.49 26.61,14.96 33.27,14.96 34,15.69 35.03,15.69 v1(35.79,16.45)
FA1: length 33.2
  Top Layer w0.152: v1(37.92,27.9) 37.93,27.91 37.93,30.34 ; v1(12.47,23.05) 12.5,23.09 12.5,26.31
  Bottom Layer w0.152: v1(37.92,27.9) 37.29,27.27 29.7,27.27 28.13,25.7 15.11,25.7 v1(12.47,23.05)
FA2: length 33.8
  Top Layer w0.152: v1(13.01,22.73) 13,22.74 13,26.31 ; v1(38.42,27.52) 38.43,27.53 38.43,30.34
  Bottom Layer w0.152: v1(13.01,22.73) 15.61,25.34 28.28,25.34 29.75,26.81 37.71,26.81 v1(38.42,27.52)
FA3: length 34.2
  Top Layer w0.152: v1(38.93,27.13) 38.93,30.34 ; v1(13.73,22.55) 13.5,22.78 13.5,26.31
  Bottom Layer w0.152: v1(13.73,22.55) 16.16,24.98 28.49,24.98 29.97,26.46 38.26,26.46 v1(38.93,27.13)
FA4: length 34.3
  Top Layer w0.152: 39.43,30.34 39.43,26.77 v1(39.43,26.77) ; v1(14.55,22.5) 14,23.05 14,26.31
  Bottom Layer w0.152: v1(39.43,26.77) 38.76,26.1 30.12,26.1 28.69,24.68 16.73,24.68 v1(14.55,22.5)
FA5: length 34.3
  Top Layer w0.152: 39.93,30.34 39.93,26.41 v1(39.92,26.4) ; v1(15.31,22.55) 14.5,23.36 14.5,26.31
  Bottom Layer w0.152: v1(15.31,22.55) 17.1,24.33 28.83,24.33 30.24,25.75 39.27,25.75 v1(39.92,26.4)
FA6: length 34.4
  Top Layer w0.152: 40.43,30.34 40.43,26.09 v1(40.46,26.06) ; 15,26.31 15,23.59 v1(16.04,22.55)
  Bottom Layer w0.152: v1(40.46,26.06) 39.79,25.39 30.38,25.39 29.01,24.02 17.51,24.02 v1(16.04,22.55)
FA7: length 34.4
  Top Layer w0.152: 40.93,30.34 40.93,25.67 v1(40.94,25.66) ; v1(16.78,22.6) 15.5,23.88 15.5,26.31
  Bottom Layer w0.152: v1(40.94,25.66) 40.31,25.04 30.52,25.04 29.2,23.72 17.9,23.72 v1(16.78,22.6)
FA8: length 35.7
  Top Layer w0.152: 19,26.31 19,23.9 v1(18.09,22.99) ; 45.93,30.34 45.93,28.4 v1(45.94,28.39)
  Bottom Layer w0.152: v1(18.09,22.99) 18.46,23.36 29.33,23.36 30.65,24.68 40.71,24.68 44.42,28.39 v1(45.94,28.39)
FA9: length 36.4
  Top Layer w0.152: v1(46.4,27.88) 46.43,27.91 46.43,30.34 ; v1(18.65,22.68) 19.5,23.53 19.5,26.31
  Bottom Layer w0.152: v1(18.65,22.68) 19.03,23.05 29.55,23.05 30.82,24.32 40.96,24.32 44.52,27.88 v1(46.4,27.88)
FA10: length 36.5
  Top Layer w0.152: 20,26.31 20,23.23 v1(19.36,22.6) ; 46.93,30.34 46.93,27.4 v1(46.91,27.37)
  Bottom Layer w0.152: v1(46.91,27.37) 44.62,27.37 41.22,23.97 30.97,23.97 29.7,22.7 19.47,22.7 v1(19.36,22.6)
FA11: length 38.3
  Top Layer w0.152: 20.5,26.31 20.5,22.96 v1(19.45,21.92) ; 47.43,30.34 47.43,26.88 v1(47.42,26.86)
  Bottom Layer w0.152: v1(47.42,26.86) 44.72,26.86 41.52,23.66 31.15,23.66 29.88,22.39 19.93,22.39 v1(19.45,21.92)
FA12: length 38.5
  Top Layer w0.152: 21,26.31 21,22.72 v1(20.13,21.85) ; 47.93,30.34 47.93,26.36 v1(47.92,26.36)
  Bottom Layer w0.152: v1(47.92,26.36) 44.88,26.36 41.88,23.36 31.34,23.36 30.07,22.09 20.37,22.09 v1(20.13,21.85)
FA13: length 39.6
  Top Layer w0.152: 21.5,26.31 21.5,22.31 v1(20.82,21.63) ; v1(48.43,25.85) 48.43,30.34
  Bottom Layer w0.152: v1(20.82,21.63) 24.15,21.63 25.09,20.69 30.17,20.69 31.92,22.44 43.05,22.44 46.45,25.85 v1(48.43,25.85)
FA14: length 40.5
  Top Layer w0.152: v1(21.25,21.14) 21.25,21.22 22,21.97 22,26.31 ; 48.93,30.34 48.94,30.33 v1(48.94,25.39)
  Bottom Layer w0.152: v1(48.94,25.39) 46.55,25.39 43.3,22.14 32.13,22.14 30.35,20.36 24.81,20.36 24.04,21.14 v1(21.25,21.14)
FA15: length 33.6
  Top Layer w0.152: U5.1 22.49,24.91 22.55,24.86 22.91,24.86 23.08,25.04 23.08,25.54 23.7,26.16 27.1,26.16 27.29,26.34 29.51,26.34 30.19,27.02 v1(30.19,28.43) ; 49.43,30.34 49.45,30.32 v1(49.45,28.9)
  Bottom Layer w0.152: v1(30.19,28.43) 35.77,28.43 37.41,30.06 48.28,30.06 v1(49.45,28.9)
GPIO0: length 4.8
  Top Layer w0.152: U6.6 5.28,23.69 5.85,23.12 U5.29
GPIO1: length 9.9
  Top Layer w0.152: R2.1 1.65,22.65 3.08,22.65 4.01,23.58 ; U6.7 4.01,23.58 ; 4.01,23.58 4.98,22.62 U5.30
GPIO2: length 2.7
  Top Layer w0.152: 8.86,23.63 7.01,23.63 6.58,24.06 6.58,24.28 6.53,24.33
LED1: length 14
  Top Layer w0.152: v2(10.18,20.11) 8.8,20.11
  Top Layer w0.203: v1(16.48,29) 15.9,29 LED1.1
  Bottom Layer w0.152: v1(16.48,29) 14.85,27.37 14.09,27.37 10.18,23.46 v2(10.18,20.11)
LED2: length 16.1
  Top Layer w0.152: 8.8,19.61 10.68,19.61 v2(10.69,19.6)
  Top Layer w0.203: LED2.1 17.55,29.05 v1(18.16,29.05)
  Bottom Layer w0.152: v2(10.69,19.6) 10.69,23.31 14.29,26.92 16.02,26.92 v1(18.16,29.05)
RD0: length 24.7
  Top Layer w0.152: v1(39.43,12.18) 39.43,12.18 39.43,10.54 ; U5.75 22.49,12.06 22.17,12.39 v1(22.07,12.39) ; v1(36.43,11.79) 35.91,12.3 35.4,12.3 35.13,12.03 35.13,10.93
  Bottom Layer w0.152: v1(39.43,12.18) 37.3,12.18 36.9,11.79 v1(36.43,11.79) 35.4,10.76 24.71,10.76 23.09,12.39 v1(22.07,12.39)
REQ: length 53
  Top Layer w0.152: v1(10.06,14.19) 9.96,14.08 9.13,14.08 ; v1(47.18,9.62) 48,8.8 48,3.1
  Bottom Layer w0.152: v1(10.06,14.19) 9.16,13.29 9.16,9.69 10.74,8.12 35.17,8.12 37.92,10.86 45.94,10.86 v1(47.18,9.62)
TCK: length 8.3
  Top Layer w0.152: v1(6.62,28.85) 9.83,28.85 11,27.68 11,26.31
  Bottom Layer w0.152: v1(6.62,28.85) 5.96,29.51 XP1.5
TDI: length 10.9
  Top Layer w0.152: 11.5,26.31 11.5,27.84 10.03,29.3 4.5,29.3 3.42,30.38 XP1.3
TDO: length 10.9
  Top Layer w0.152: 10.5,26.31 10.5,27.44 9.6,28.34 4.2,28.34 2.15,30.38 XP1.2
TMS: length 10.3
  Top Layer w0.152: XP1.4 4.69,30.27 5.3,29.66 10.37,29.66 12,28.03 12,26.31
VMIX: length 20
  Top Layer w0.254: v2(2.74,23.42) 2.74,24.7 U6.8 ; 3.07,13.69 4.71,13.69 4.72,13.68 5.94,13.68 C5.2
  Top Layer w0.508: v2(6.33,14.72) 6.33,14.19 C5.2
  Bottom Layer w0.254: v2(2.74,23.42) 7.33,23.42 8.45,22.29 8.45,19.98 6.33,17.86 v2(6.33,14.72)
XIN: length 6.7
  Top Layer w0.152: 1.4,14.12 1.4,16.23 X1.2 1.39,16.56 2.39,17.57 3.78,17.57 4.03,17.82 4.03,18.88 U6.2
XOUT: length 3.2
  Top Layer w0.152: U6.3 5.28,17.91 3.94,16.56 X1.1
~CS2~: length 37.1
  Top Layer w0.152: 34.11,10.93 34.11,15.12 v1(34.23,15.23) ; v1(25.77,14.97) 25.77,18.54 25.2,19.11 24.2,19.11 ; 46.49,3.67 46.49,7.73 45.28,8.93 34.77,8.93 34.13,9.57 34.13,10.93
  Bottom Layer w0.152: v1(25.77,14.97) 26.12,14.62 33.61,14.62 v1(34.23,15.23)
~CS~: length 42.6
  Top Layer w0.152: v1(38.48,11.73) 38.44,11.69 U2.32 ; U5.50 9.75,12.62 10.03,12.34 10.03,9.79 v2(9.95,9.72) 9,8.77 9,3.67
  Bottom Layer w0.152: v2(9.95,9.72) 11.25,8.42 25.85,8.42 27.48,10.05 33.49,10.05 34.35,9.19 35.07,9.19 37.61,11.73 v1(38.48,11.73)
~RD~: length 12
  Top Layer w0.152: U5.49 8.77,13.1 7.79,13.1 7.58,12.89 7.58,12 6.5,10.91 6.5,8.04 7.49,7.05 7.49,3.11 7.5,3.1
~WR~: length 67.5
  Top Layer w0.152: v1(12.81,18.3) 11.96,17.45 11.96,14.72 10.84,13.6 7.79,13.6 7.23,13.04 7.23,12.15 6.12,11.04 6.12,3.22 6,3.1 ; v1(33.46,21.07) 33.46,21.93 32.13,23.26 32.13,25 ; 44.43,30.34 44.43,25.41 46.01,23.83 v1(46.3,23.83)
  Bottom Layer w0.152: v1(46.3,23.83) 44,21.53 33.91,21.53 v1(33.46,21.07) 32.95,20.57 32.18,20.57 30.91,19.3 13.8,19.3 v1(12.81,18.3)
$1N77583: length 3.3
  Top Layer w0.508: R1.1 17.49,30.59 LED2.2

## Copper pours and planes (outline as drawn; the poured copper is in the pictures)
GND on Top Layer: -4.15,34.18 57.93,34.18 57.93,-4.68 -4.15,-4.68
GND on Bottom Layer: -3.2,33.91 58.32,33.91 58.32,-5.11 -3.2,-5.11

Small or netless copper shapes (teardrops, artwork), in the pictures only: 411 on Top Layer, 173 on Bottom Layer

## Text on the board
Top Silkscreen Layer: JLCJLCJLCJLC | Rev1.1 | Designed by Bread | Layout by Mori | TDO | TDI | TMS | TCK | GND | BAT+ | BAT- | VCC | ChisFlash                F32F128V01
